# EAGLE design childboard_adapter_shield_v1 (EAGLE 6.3)
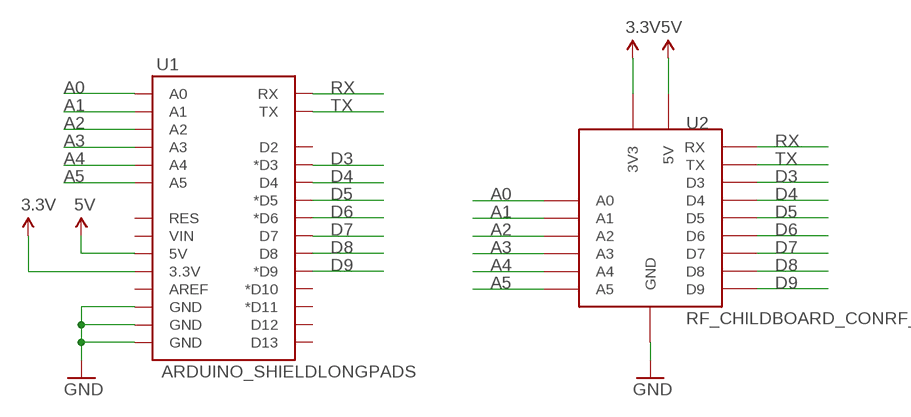
[diagram p0: schematic, sheet 1]

## Parts
U1  ARDUINO_SHIELDLONGPADS  [DUEMILANOVE_SHIELD_LONGPADS]
U2  RF_CHILDBOARD_CONRF_C  [RF_CHILDBOARD_CON]

## Nets
3.3V: U1.3.3V U2.3V3
5V: U1.5V U2.5V
A0: U1.A0 U2.A0
A1: U1.A1 U2.A1
A2: U1.A2 U2.A2
A3: U1.A3 U2.A3
A4: U1.A4 U2.A4
A5: U1.A5 U2.A5
D3: U1.D3(*D3) U2.D3
D4: U1.D4 U2.D4
D5: U1.D5(*D5) U2.D5
D6: U1.D6(*D6) U2.D6
D7: U1.D7 U2.D7
D8: U1.D8 U2.D8
D9: U1.D9(*D9) U2.D9
GND: U1.GND@0(GND) U1.GND@1(GND) U1.GND@2(GND) U2.GND U2.GND1(GND) U2.GND2(GND)
RX: U1.RX U2.RX
TX: U1.TX U2.TX
Unconnected: U1.AREF U1.D2 U1.D10(*D10) U1.D11(*D11) U1.D12 U1.D13 U1.RES U1.VIN

## Library data of the parts
U1 = SparkFun-Boards:ARDUINO_SHIELD: Arduino shield footprint
U2 = lxrobotics:RF_CHILDBOARD_CON

## Board
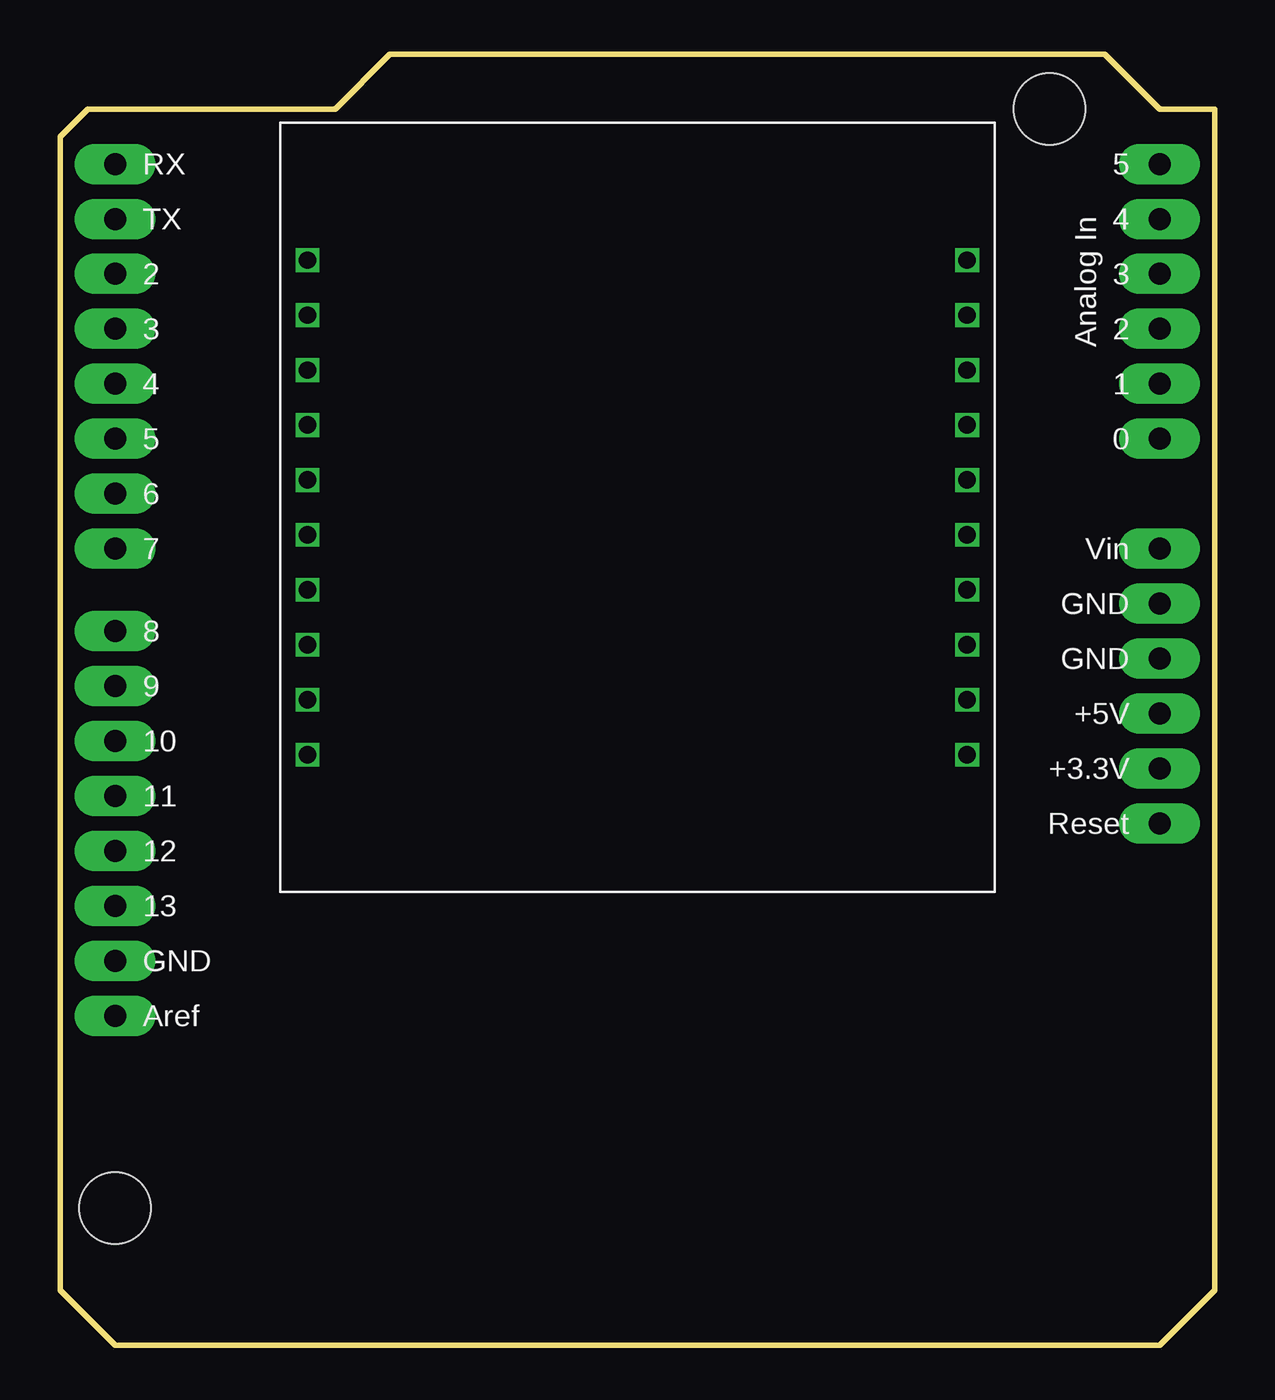
[diagram p1: board, top side]
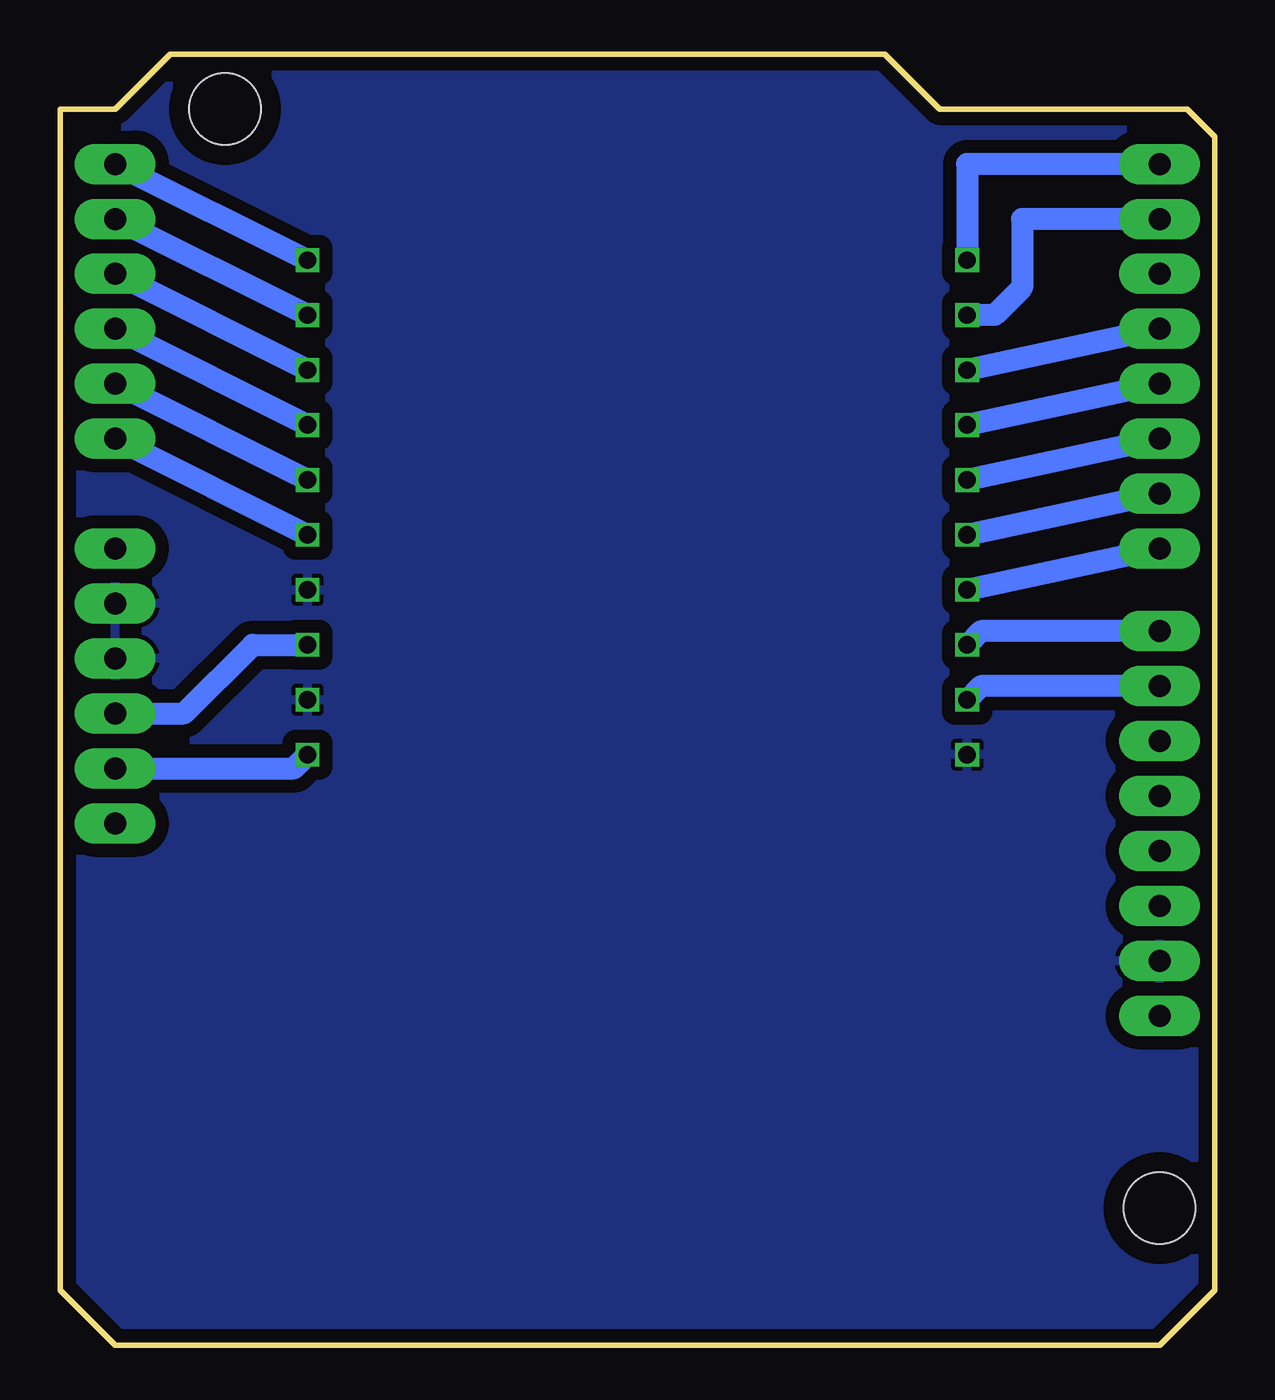
[diagram p2: board, bottom side, seen from below]

Size 53.34 x 59.69 mm. Coordinates in mm from the lower left corner, seen from the top.
Outline: 0,2.54 2.54,0 50.8,0 53.34,2.54 53.34,57.15 50.8,57.15 48.26,59.69 15.24,59.69 12.7,57.15 1.27,57.15 0,55.88 0,2.54
Copper layers (1*16): Top 0.035mm / dielectric 1.5mm / Bottom 0.035mm
Design rules "LeitOn - Standard-Eagle-DRU - 1- und  2-Lagen DK - deutsch - Rev 2.0": minimum track width 0.15mm, minimum drill 0.3mm, track to track 0.15mm, track to pad 0.15mm, pad to pad 0.15mm, via to via 0.15mm, smd to smd 0.15mm, copper to edge 0.3mm, drill to drill 0.3mm, minimum pad ring 0.15mm, minimum via ring 0.15mm, stop-mask expansion 0.075mm, vias tented up to drill 0mil, thermal gap 0.2mm

### Footprints (pad centres in the part's own frame; a part is rotated, then mirrored left to right if it is on the bottom)
DUEMILANOVE_SHIELD_LONGPADS = drill 1.016 pad 1.88 long: 3.3V 50.8,26.67; 5V 50.8,29.21; A0 50.8,41.91; A1 50.8,44.45; A2 50.8,46.99; A3 50.8,49.53; A4 50.8,52.07; A5 50.8,54.61; AREF 2.54,15.24; D2 2.54,49.53; D3 2.54,46.99; D4 2.54,44.45; D5 2.54,41.91; D6 2.54,39.37; D7 2.54,36.83; D8 2.54,33.02; D9 2.54,30.48; D10 2.54,27.94; D11 2.54,25.4; D12 2.54,22.86; D13 2.54,20.32; GND@0 50.8,31.75; GND@1 50.8,34.29; GND@2 2.54,17.78; RES 50.8,24.13; RX 2.54,54.61; TX 2.54,52.07; VIN 50.8,36.83 | hole 3.302: 45.72,57.15; 2.54,6.35
RF_CHILDBOARD_CON = drill 0.8 square: 3V3 12.7,30.48; 5V 7.62,30.48; A0 2.54,30.48; A1 0,30.48; A2 -2.54,30.48; A3 -5.08,30.48; A4 -7.62,30.48; A5 -10.16,30.48; D3 -5.08,0; D4 -2.54,0; D5 0,0; D6 2.54,0; D7 5.08,0; D8 7.62,0; D9 10.16,0; GND 5.08,30.48; GND1 10.16,30.48; GND2 12.7,0; RX -10.16,0; TX -7.62,0

### Placement (x,y rotation side)
U1  0,0 0 top
U2  11.43,40.01 270 top

### Tracks (layer width: path | path; a pad name or v marks a point on that pad's centre or on a via)
3.3V
  Bottom 1.016: U1.3.3V 42.55,26.67 U2.3V3
5V
  Bottom 1.016: U1.5V 47.62,29.21 44.45,32.38 U2.5V
A0
  Bottom 1.016: U1.A0 U2.A0
A1
  Bottom 1.016: U2.A1 U1.A1
A2
  Bottom 1.016: U1.A2 U2.A2
A3
  Bottom 1.016: U2.A3 U1.A3
A4
  Bottom 1.016: U2.A4 U1.A4
A5
  Bottom 1.016: U1.A5 U2.A5
D3
  Bottom 1.016: U1.D3 U2.D3
D4
  Bottom 1.016: U1.D4 U2.D4
D5
  Bottom 1.016: U1.D5 U2.D5
D6
  Bottom 1.016: U1.D6 U2.D6
D7
  Bottom 1.016: U1.D7 U2.D7
D8
  Bottom 1.016: U1.D8 10.8,33.02 U2.D8
D9
  Bottom 1.016: U1.D9 10.8,30.48 U2.D9
GND
  pour Bottom (isolate 0.61): 0.64,2.54 2.54,0.63 50.8,0.63 52.7,2.54 52.7,56.51 50.17,56.51 47.62,59.05 15.24,59.05 12.7,56.51 1.91,56.51 0.64,55.24
RX
  Bottom 1.016: U1.RX 11.43,54.61 U2.RX
TX
  Bottom 1.016: U1.TX 8.89,52.07 8.89,48.9 10.16,47.62 U2.TX